# EAGLE schematic Motor Control (EAGLE 9.6.2)
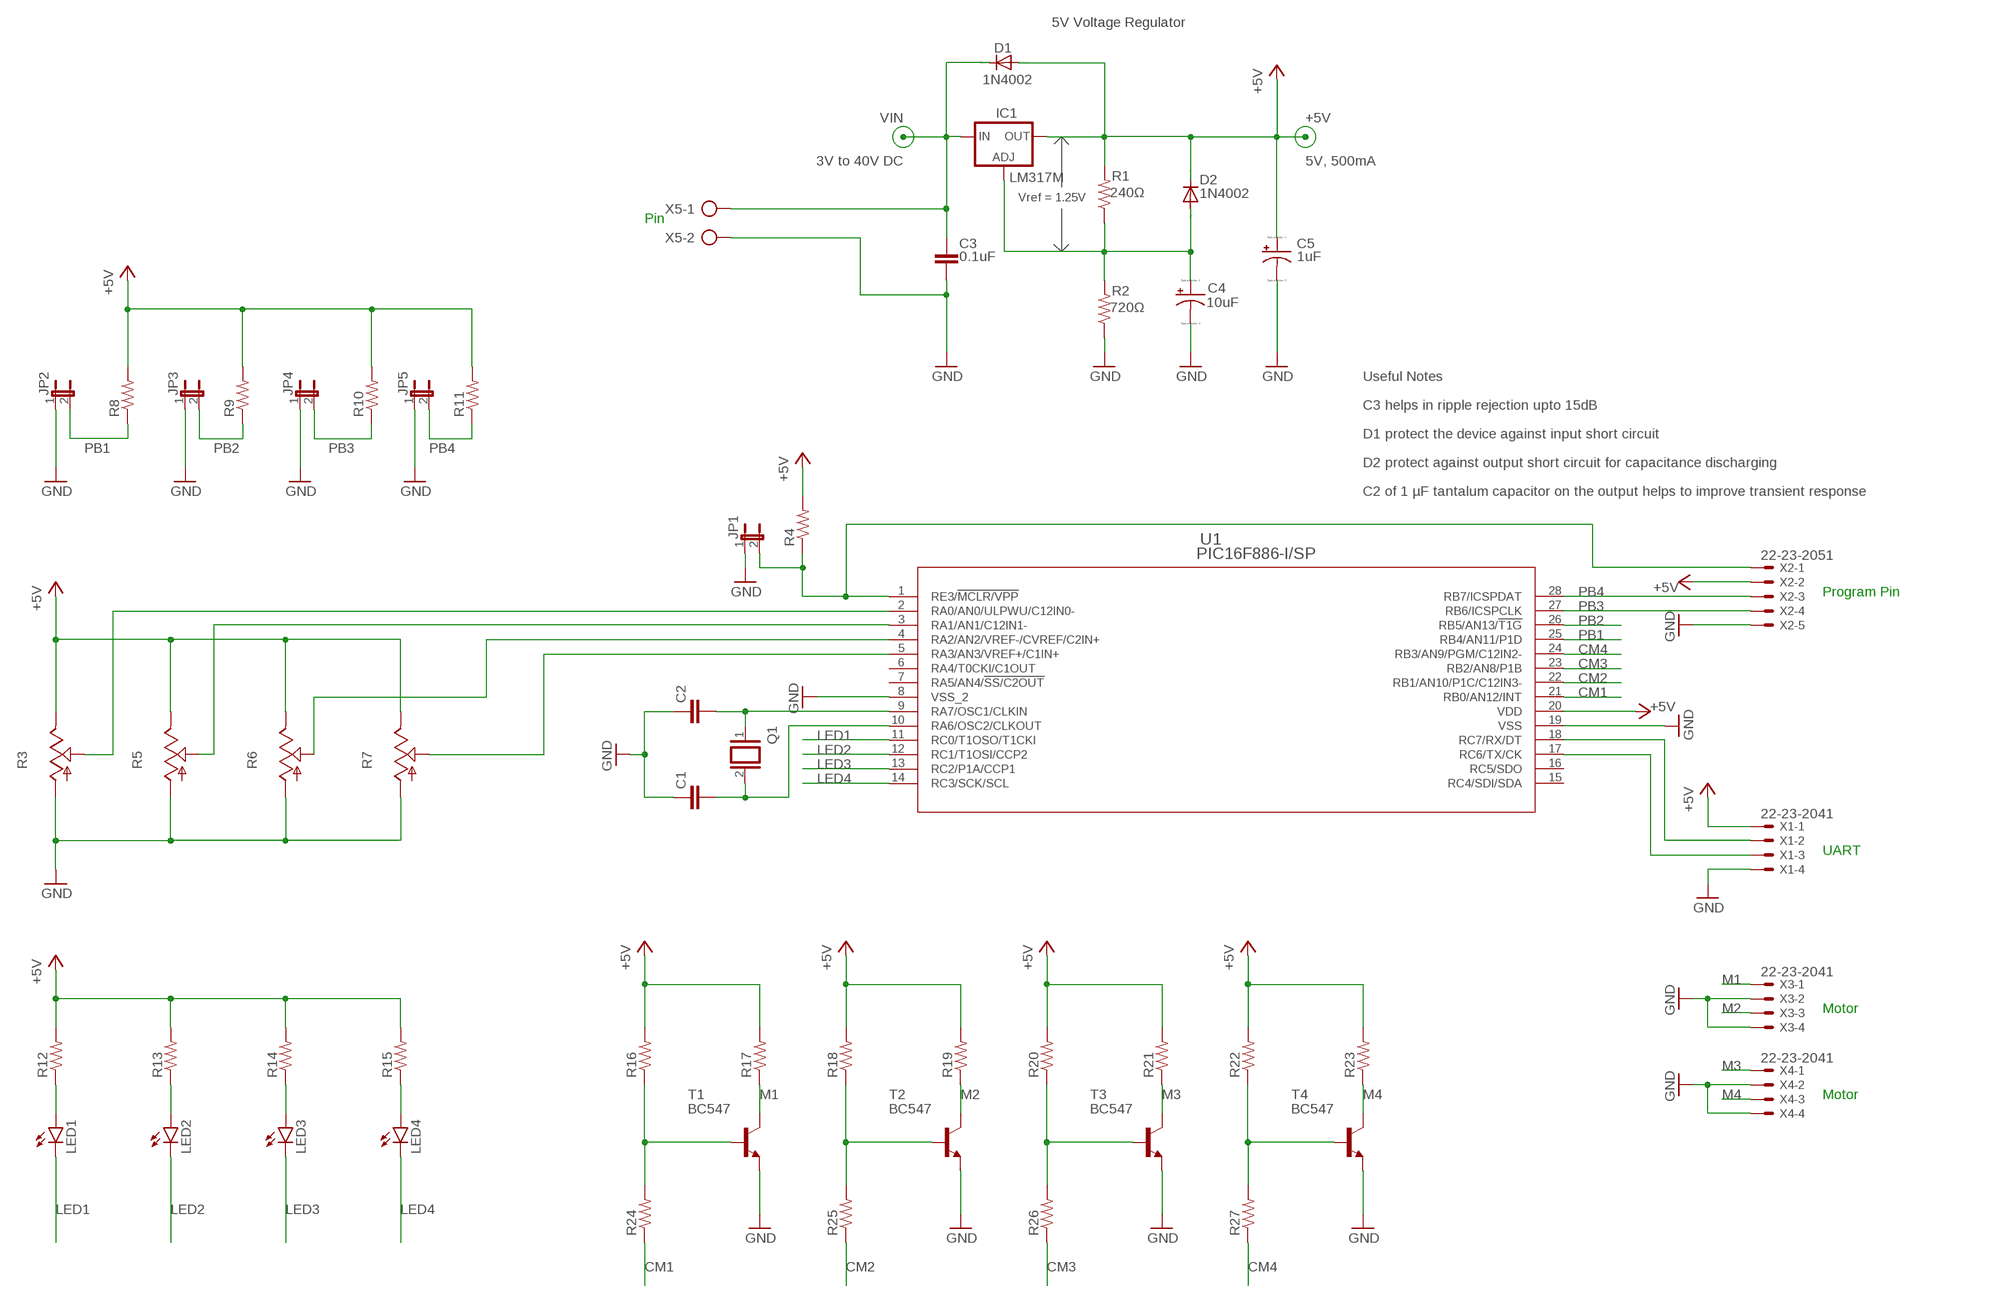
[diagram p0: schematic, sheet 1]

## Parts
C1  C-EUC0805  [C0805]
C2  C-EUC0805  [C0805]
C3  0.1uF  C-EU075-052X106  [C075-052X106]
C4  10uF  CPOL-US085CS-1AR  [085CS_1AR]
C5  1uF  CPOL-US085CS-1AR  [085CS_1AR]
D1  1N4002  1N4004  [DO41-10]
D2  1N4002  1N4004  [DO41-10]
IC1  LM317MBSTT3  [SOT223]
JP1  JP1E  [JP1]
JP2  JP1E  [JP1]
JP3  JP1E  [JP1]
JP4  JP1E  [JP1]
JP5  JP1E  [JP1]
LED1  LED3MM  [LED3MM]
LED2  LED3MM  [LED3MM]
LED3  LED3MM  [LED3MM]
LED4  LED3MM  [LED3MM]
Q1  XTAL/S  [QS]
R1  240Ω  R-US_M0805  [M0805]
R2  720Ω  R-US_M0805  [M0805]
R3  TRIM_US-LI15  [LI15]
R4  R-US_0204/7  [0204/7]
R5  TRIM_US-LI15  [LI15]
R6  TRIM_US-LI15  [LI15]
R7  TRIM_US-LI15  [LI15]
R8  R-US_0204/7  [0204/7]
R9  R-US_0204/7  [0204/7]
R10  R-US_0204/7  [0204/7]
R11  R-US_0204/7  [0204/7]
R12  R-US_0204/7  [0204/7]
R13  R-US_0204/7  [0204/7]
R14  R-US_0204/7  [0204/7]
R15  R-US_0204/7  [0204/7]
R16  R-US_0204/7  [0204/7]
R17  R-US_0204/7  [0204/7]
R18  R-US_0204/7  [0204/7]
R19  R-US_0204/7  [0204/7]
R20  R-US_0204/7  [0204/7]
R21  R-US_0204/7  [0204/7]
R22  R-US_0204/7  [0204/7]
R23  R-US_0204/7  [0204/7]
R24  R-US_0204/7  [0204/7]
R25  R-US_0204/7  [0204/7]
R26  R-US_0204/7  [0204/7]
R27  R-US_0204/7  [0204/7]
T1  BC547  [TO92]
T2  BC547  [TO92]
T3  BC547  [TO92]
T4  BC547  [TO92]
U1  PIC16F886-I/SP  [SPDIP28_300MC_MCH]
X1  22-23-2041  [22-23-2041]
X2  22-23-2051  [22-23-2051]
X3  22-23-2041  [22-23-2041]
X4  22-23-2041  [22-23-2041]
X5  AK300/2  [AK300/2]

## Nets
+5V: C5.+ D1.A D2.C IC1.4(OUT) R1.2 R3.E R4.2 R5.E R6.E R7.E R8.2 R9.2 R10.2 R11.2 R12.2 R13.2 R14.2 R15.2 R16.2 R17.2 R18.2 R19.2 R20.2 R21.2 R22.2 R23.2 U1.20(VDD) X1.1 X2.2
CM1: R24.1 U1.21(RB0/AN12/INT)
CM2: R25.1 U1.22(RB1/AN10/P1C/C12IN3-)
CM3: R26.1 U1.23(RB2/AN8/P1B)
CM4: R27.1 U1.24(RB3/AN9/PGM/C12IN2-)
GND: C1.1 C2.1 C3.2 C4.- C5.- JP1.1 JP2.1 JP3.1 JP4.1 JP5.1 R2.1 R3.A R5.A R6.A R7.A T1.1(E) T2.1(E) T3.1(E) T4.1(E) U1.8(VSS_2) U1.19(VSS) X1.4 X2.5 X3.2 X3.4 X4.2 X4.4 X5.2
LED1: LED1.K(C) U1.11(RC0/T1OSO/T1CKI)
LED2: LED2.K(C) U1.12(RC1/T1OSI/CCP2)
LED3: LED3.K(C) U1.13(RC2/P1A/CCP1)
LED4: LED4.K(C) U1.14(RC3/SCK/SCL)
M1: R17.1 T1.3(C) X3.1
M2: R19.1 T2.3(C) X3.3
M3: R21.1 T3.3(C) X4.1
M4: R23.1 T4.3(C) X4.3
N$1: C4.+ D2.A IC1.1(ADJ) R1.1 R2.2
N$2: C2.2 Q1.1 U1.9(RA7/OSC1/CLKIN)
N$3: C1.2 Q1.2 U1.10(RA6/OSC2/CLKOUT)
N$4: JP1.2 R4.1 U1.1(RE3/!MCLR/VPP) X2.1
N$7: LED1.A R12.1
N$8: LED2.A R13.1
N$9: R7.S U1.5(RA3/AN3/VREF+/C1IN+)
N$10: R6.S U1.4(RA2/AN2/VREF-/CVREF/C2IN+)
N$11: R5.S U1.3(RA1/AN1/C12IN1-)
N$12: R3.S U1.2(RA0/AN0/ULPWU/C12IN0-)
N$13: U1.18(RC7/RX/DT) X1.2
N$14: U1.17(RC6/TX/CK) X1.3
N$20: R16.1 R24.2 T1.2(B)
N$21: LED3.A R14.1
N$22: LED4.A R15.1
N$24: R18.1 R25.2 T2.2(B)
N$26: R20.1 R26.2 T3.2(B)
N$28: R22.1 R27.2 T4.2(B)
PB1: JP2.2 R8.1 U1.25(RB4/AN11/P1D)
PB2: JP3.2 R9.1 U1.26(RB5/AN13/!T1G)
PB3: JP4.2 R10.1 U1.27(RB6/ICSPCLK) X2.4
PB4: JP5.2 R11.1 U1.28(RB7/ICSPDAT) X2.3
VIN: C3.1 D1.C IC1.3(IN) X5.1
Unconnected: U1.6(RA4/T0CKI/C1OUT) U1.7(RA5/AN4/!SS/C2OUT) U1.15(RC4/SDI/SDA) U1.16(RC5/SDO)

## Notes on the sheet
- 5V Voltage Regulator
- 3V to 40V DC | 5V, 500mA
- Vref = 1.25V
- Pin
- Useful Notes
- C3 helps in ripple rejection upto 15dB
- D1 protect the device against input short circuit
- D2 protect against output short circuit for capacitance discharging
- C2 of 1 µF tantalum capacitor on the output helps to improve transient response
- Program Pin
- UART
- Motor
- Motor

## Library data of the parts
C1-C3 = rcl:C-EU: CAPACITOR, European symbol; SPICEPREFIX: C
C4 C5 = resistor:CPOL-US: POLARIZED CAPACITOR, American symbol
D1 D2 = diode:1N4004: DIODE general purpose rectifier, 1 A
IC1 = v-reg:LM317?*: 500 mA Adjustable Output Positive Voltage Regulator Source: http://www.onsemi.co.jp .. LM317M-D.PDF; PARTNUMBER: LM317M
JP1-JP5 = jumper:JP1E: JUMPER
LED1-LED4 = led:LED: LED OSRAM: - CHIPLED LG R971, LG N971, LY N971, LG Q971, LY Q971, LO R971, LY R971 LH N974, LH R974 LS Q976, LO Q976, LY Q976 LO Q996 - Hyper CHIPLED LW Q18S LB Q993, LB Q99A, LB R99A - SideLED LS A670, LO A670, LY A670, LG A670, LP A670 LB A673, LV A673, LT A673, LW A673 LH A674 LY A675 LS A676, LA A676, LO A676, LY A676, LW A676 LS A679, LY A679, LG A679 - Hyper Micro SIDELED® LS Y876, LA Y876, LO Y876, LY Y876 LT Y87S - SmartLED LW L88C, LW L88S LB L89C, LB L89S, LG L890 LS L89K, LO L89K, LY L89K LS L896, LA L896, LO L896, LY L896 - TOPLED LS T670, LO T670, LY T670, LG T670, LP T670 LSG T670, LSP T670, LSY T670, LOP T670, LYG T670 LG T671, LOG T671, LSG T671 LB T673, LV T673, LT T673, LW T673 LH T674 LS T676, LA T676, LO T676, LY T676, LB T676, LH T676, LSB T676, LW T676 LB T67C, LV T67C, LT T67C, LS T67K, LO T67K, LY T67K, LW E67C LS E67B, LA E67B, LO E67B, LY E67B, LB E67C, LV E67C, LT E67C LW T67C LS T679, LY T679, LG T679 LS T770, LO T770, LY T770, LG T770, LP T770 LB T773, LV T773, LT T773, LW T773 LH T774 LS E675, LA E675, LY E675, LS T675 LS T776, LA T776, LO T776, LY T776, LB T776 LHGB T686 LT T68C, LB T68C - Hyper Mini TOPLED® LB M676 - Mini TOPLED Santana® LG M470 LS M47K, LO M47K, LY M47K Source: http://www.osram.convergy.de LUXEON: - LUMILED® LXK2-PW12-R00, LXK2-PW12-S00, LXK2-PW14-U00, LXK2-PW14-V00 LXK2-PM12-R00, LXK2-PM12-S00, LXK2-PM14-U00 LXK2-PE12-Q00, LXK2-PE12-R00, LXK2-PE12-S00, LXK2-PE14-T00, LXK2-PE14-U00 LXK2-PB12-K00, LXK2-PB12-L00, LXK2-PB12-M00, LXK2-PB14-N00, LXK2-PB14-P00, LXK2-PB14-Q00 LXK2-PR12-L00, LXK2-PR12-M00, LXK2-PR14-Q00, LXK2-PR14-R00 LXK2-PD12-Q00, LXK2-PD12-R00, LXK2-PD12-S00 LXK2-PH12-R00, LXK2-PH12-S00 LXK2-PL12-P00, LXK2-PL12-Q00, LXK2-PL12-R00 Source: www.luxeon.com KINGBRIGHT: KA-3528ASYC Source: www.kingbright.com
Q1 = special:XTAL/S: CRYSTAL
R1 R2 = resistor:R-US_: RESISTOR, American symbol
R3 R5-R7 = pot:TRIM_US-: POTENTIOMETER
R4 R8-R27 = rcl:R-US_: RESISTOR, American symbol; SPICEPREFIX: R
T1-T4 = transistor:BC547: NPN TRANSISTOR
U1 = Microchip:PIC16F886-I/SP; COPYRIGHT: Copyright (C) 2022 Ultra Librarian. All rights reserved.; MANUFACTURER_PART_NUMBER: PIC16F886-I/SP; MFR_NAME: Microchip
X1 X3 X4 = con-molex:22-23-2041: .100" (2.54mm) Center Header - 4 Pin; MF: MOLEX; MPN: 22-23-2041; OC_FARNELL: 1462920; OC_NEWARK: 38C0355
X2 = con-molex:22-23-2051: .100" (2.54mm) Center Header - 5 Pin; MF: MOLEX; MPN: 22-23-2051; OC_FARNELL: 1462952; OC_NEWARK: 38C9178
X5 = con-ptr500:AK300/2: CONNECTOR; OC_FARNELL: unknown; OC_NEWARK: unknown